# Altium schematic sheet core.SchDoc
size A4; SheetNumber: 3; SheetTotal: 5
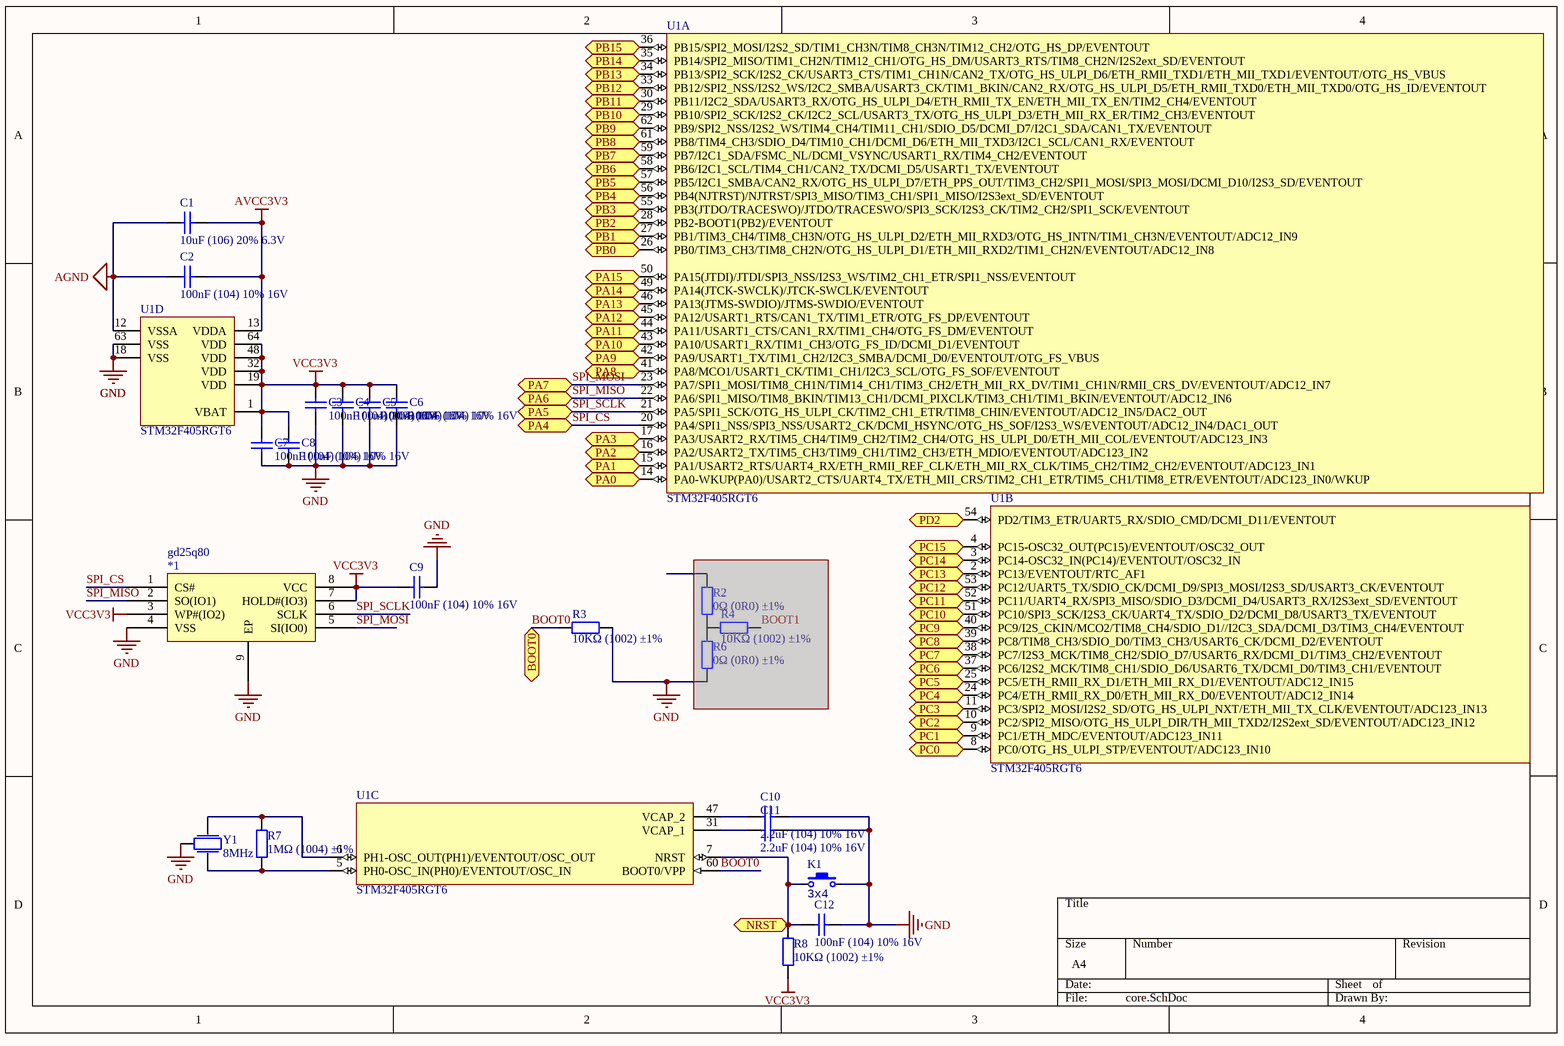
[diagram p0: core.SchDoc]

## Parts
*1  gd25q80  [USON-8]
C1  10uF (106) 20% 6.3V  [LC-0402_C]
C2  100nF (104) 10% 16V  [LC-0402_C]
C3  100nF (104) 10% 16V  [LC-0402_C]
C4  100nF (104) 10% 16V  [LC-0402_C]
C5  100nF (104) 10% 16V  [LC-0402_C]
C6  100nF (104) 10% 16V  [LC-0402_C]
C7  100nF (104) 10% 16V  [LC-0402_C]
C8  100nF (104) 10% 16V  [LC-0402_C]
C9  100nF (104) 10% 16V  [LC-0402_C]
C10  2.2uF (104) 10% 16V  [LC-0402_C]
C11  2.2uF (104) 10% 16V  [LC-0402_C]
C12  100nF (104) 10% 16V  [LC-0402_C]
K1  value 3x4  [ButtonTACT_3x4x2_180]  (hidden comment: TACT 2P)
R2  0Ω (0R0) ±1%  [LC-0402_R]  (masked out: inside a compile mask, not in the netlist)
R3  10KΩ (1002) ±1%  [LC-0402_R]
R4  10KΩ (1002) ±1%  [LC-0402_R]  (masked out: inside a compile mask, not in the netlist)
R6  0Ω (0R0) ±1%  [LC-0402_R]  (masked out: inside a compile mask, not in the netlist)
R7  1MΩ (1004) ±1%  [LC-0402_R]
R8  10KΩ (1002) ±1%  [LC-0402_R]
U1  STM32F405RGT6  [LC-LQFP-64_10x10x05P]  (parts A,B,C,D of 4)
Y1  8MHz  [晶振-3P]

## Ports
BOOT0 (bidir), NRST (bidir), PA0 (bidir), PA1 (bidir), PA2 (bidir), PA3 (bidir), PA4 (bidir), PA5 (bidir), PA6 (bidir), PA7 (bidir), PA8 (bidir), PA9 (bidir), PA10 (bidir), PA11 (bidir), PA12 (bidir), PA13 (bidir), PA14 (bidir), PA15 (bidir), PB0 (bidir), PB1 (bidir), PB2 (bidir), PB3 (bidir), PB4 (bidir), PB5 (bidir), PB6 (bidir), PB7 (bidir), PB8 (bidir), PB9 (bidir), PB10 (bidir), PB11 (bidir), PB12 (bidir), PB13 (bidir), PB14 (bidir), PB15 (bidir), PC0 (bidir), PC1 (bidir), PC2 (bidir), PC3 (bidir), PC4 (bidir), PC5 (bidir), PC6 (bidir), PC7 (bidir), PC8 (bidir), PC9 (bidir), PC10 (bidir), PC11 (bidir), PC12 (bidir), PC13 (bidir), PC14 (bidir), PC15 (bidir), PD2 (bidir)

## Nets
AGND: C1.1 C2.2 U1.12(VSSA)
AVCC3V3: C1.2 C2.1 U1.13(VDDA)
GND: *1.4(VSS) *1.9(EP) C3.1 C4.1 C5.1 C6.1 C7.1 C8.1 C9.1 C10.1 C11.1 C12.1 K1.2 R3.1 U1.18(VSS) U1.63(VSS) Y1.2
VCC3V3: *1.3(WP#(IO2)) *1.7(HOLD#(IO3)) *1.8(VCC) C3.2 C4.2 C5.2 C6.2 C7.2 C8.2 C9.2 R8.1 U1.1(VBAT) U1.19(VDD) U1.32(VDD) U1.48(VDD) U1.64(VDD)
BOOT0: R3.2 U1.60(BOOT0/VPP) ; port BOOT0
NRST: C12.2 K1.1 R8.2 U1.7(NRST) ; port NRST
PA0: U1.14(PA0-WKUP(PA0)/USART2_CTS/UART4_TX/ETH_MII_CRS/TIM2_CH1_ETR/TIM5_CH1/TIM8_ETR/EVENTOUT/ADC123_IN0/WKUP) ; port PA0
PA1: U1.15(PA1/USART2_RTS/UART4_RX/ETH_RMII_REF_CLK/ETH_MII_RX_CLK/TIM5_CH2/TIM2_CH2/EVENTOUT/ADC123_IN1) ; port PA1
PA2: U1.16(PA2/USART2_TX/TIM5_CH3/TIM9_CH1/TIM2_CH3/ETH_MDIO/EVENTOUT/ADC123_IN2) ; port PA2
PA3: U1.17(PA3/USART2_RX/TIM5_CH4/TIM9_CH2/TIM2_CH4/OTG_HS_ULPI_D0/ETH_MII_COL/EVENTOUT/ADC123_IN3) ; port PA3
PA8: U1.41(PA8/MCO1/USART1_CK/TIM1_CH1/I2C3_SCL/OTG_FS_SOF/EVENTOUT) ; port PA8
PA9: U1.42(PA9/USART1_TX/TIM1_CH2/I2C3_SMBA/DCMI_D0/EVENTOUT/OTG_FS_VBUS) ; port PA9
PA10: U1.43(PA10/USART1_RX/TIM1_CH3/OTG_FS_ID/DCMI_D1/EVENTOUT) ; port PA10
PA11: U1.44(PA11/USART1_CTS/CAN1_RX/TIM1_CH4/OTG_FS_DM/EVENTOUT) ; port PA11
PA12: U1.45(PA12/USART1_RTS/CAN1_TX/TIM1_ETR/OTG_FS_DP/EVENTOUT) ; port PA12
PA13: U1.46(PA13(JTMS-SWDIO)/JTMS-SWDIO/EVENTOUT) ; port PA13
PA14: U1.49(PA14(JTCK-SWCLK)/JTCK-SWCLK/EVENTOUT) ; port PA14
PA15: U1.50(PA15(JTDI)/JTDI/SPI3_NSS/I2S3_WS/TIM2_CH1_ETR/SPI1_NSS/EVENTOUT) ; port PA15
PB0: U1.26(PB0/TIM3_CH3/TIM8_CH2N/OTG_HS_ULPI_D1/ETH_MII_RXD2/TIM1_CH2N/EVENTOUT/ADC12_IN8) ; port PB0
PB1: U1.27(PB1/TIM3_CH4/TIM8_CH3N/OTG_HS_ULPI_D2/ETH_MII_RXD3/OTG_HS_INTN/TIM1_CH3N/EVENTOUT/ADC12_IN9) ; port PB1
PB2: U1.28(PB2-BOOT1(PB2)/EVENTOUT) ; port PB2
PB3: U1.55(PB3(JTDO/TRACESWO)/JTDO/TRACESWO/SPI3_SCK/I2S3_CK/TIM2_CH2/SPI1_SCK/EVENTOUT) ; port PB3
PB4: U1.56(PB4(NJTRST)/NJTRST/SPI3_MISO/TIM3_CH1/SPI1_MISO/I2S3ext_SD/EVENTOUT) ; port PB4
PB5: U1.57(PB5/I2C1_SMBA/CAN2_RX/OTG_HS_ULPI_D7/ETH_PPS_OUT/TIM3_CH2/SPI1_MOSI/SPI3_MOSI/DCMI_D10/I2S3_SD/EVENTOUT) ; port PB5
PB6: U1.58(PB6/I2C1_SCL/TIM4_CH1/CAN2_TX/DCMI_D5/USART1_TX/EVENTOUT) ; port PB6
PB7: U1.59(PB7/I2C1_SDA/FSMC_NL/DCMI_VSYNC/USART1_RX/TIM4_CH2/EVENTOUT) ; port PB7
PB8: U1.61(PB8/TIM4_CH3/SDIO_D4/TIM10_CH1/DCMI_D6/ETH_MII_TXD3/I2C1_SCL/CAN1_RX/EVENTOUT) ; port PB8
PB9: U1.62(PB9/SPI2_NSS/I2S2_WS/TIM4_CH4/TIM11_CH1/SDIO_D5/DCMI_D7/I2C1_SDA/CAN1_TX/EVENTOUT) ; port PB9
PB10: U1.29(PB10/SPI2_SCK/I2S2_CK/I2C2_SCL/USART3_TX/OTG_HS_ULPI_D3/ETH_MII_RX_ER/TIM2_CH3/EVENTOUT) ; port PB10
PB11: U1.30(PB11/I2C2_SDA/USART3_RX/OTG_HS_ULPI_D4/ETH_RMII_TX_EN/ETH_MII_TX_EN/TIM2_CH4/EVENTOUT) ; port PB11
PB12: U1.33(PB12/SPI2_NSS/I2S2_WS/I2C2_SMBA/USART3_CK/TIM1_BKIN/CAN2_RX/OTG_HS_ULPI_D5/ETH_RMII_TXD0/ETH_MII_TXD0/OTG_HS_ID/EVENTOUT) ; port PB12
PB13: U1.34(PB13/SPI2_SCK/I2S2_CK/USART3_CTS/TIM1_CH1N/CAN2_TX/OTG_HS_ULPI_D6/ETH_RMII_TXD1/ETH_MII_TXD1/EVENTOUT/OTG_HS_VBUS) ; port PB13
PB14: U1.35(PB14/SPI2_MISO/TIM1_CH2N/TIM12_CH1/OTG_HS_DM/USART3_RTS/TIM8_CH2N/I2S2ext_SD/EVENTOUT) ; port PB14
PB15: U1.36(PB15/SPI2_MOSI/I2S2_SD/TIM1_CH3N/TIM8_CH3N/TIM12_CH2/OTG_HS_DP/EVENTOUT) ; port PB15
PC0: U1.8(PC0/OTG_HS_ULPI_STP/EVENTOUT/ADC123_IN10) ; port PC0
PC1: U1.9(PC1/ETH_MDC/EVENTOUT/ADC123_IN11) ; port PC1
PC2: U1.10(PC2/SPI2_MISO/OTG_HS_ULPI_DIR/TH_MII_TXD2/I2S2ext_SD/EVENTOUT/ADC123_IN12) ; port PC2
PC3: U1.11(PC3/SPI2_MOSI/I2S2_SD/OTG_HS_ULPI_NXT/ETH_MII_TX_CLK/EVENTOUT/ADC123_IN13) ; port PC3
PC4: U1.24(PC4/ETH_RMII_RX_D0/ETH_MII_RX_D0/EVENTOUT/ADC12_IN14) ; port PC4
PC5: U1.25(PC5/ETH_RMII_RX_D1/ETH_MII_RX_D1/EVENTOUT/ADC12_IN15) ; port PC5
PC6: U1.37(PC6/I2S2_MCK/TIM8_CH1/SDIO_D6/USART6_TX/DCMI_D0/TIM3_CH1/EVENTOUT) ; port PC6
PC7: U1.38(PC7/I2S3_MCK/TIM8_CH2/SDIO_D7/USART6_RX/DCMI_D1/TIM3_CH2/EVENTOUT) ; port PC7
PC8: U1.39(PC8/TIM8_CH3/SDIO_D0/TIM3_CH3/USART6_CK/DCMI_D2/EVENTOUT) ; port PC8
PC9: U1.40(PC9/I2S_CKIN/MCO2/TIM8_CH4/SDIO_D1//I2C3_SDA/DCMI_D3/TIM3_CH4/EVENTOUT) ; port PC9
PC10: U1.51(PC10/SPI3_SCK/I2S3_CK/UART4_TX/SDIO_D2/DCMI_D8/USART3_TX/EVENTOUT) ; port PC10
PC11: U1.52(PC11/UART4_RX/SPI3_MISO/SDIO_D3/DCMI_D4/USART3_RX/I2S3ext_SD/EVENTOUT) ; port PC11
PC12: U1.53(PC12/UART5_TX/SDIO_CK/DCMI_D9/SPI3_MOSI/I2S3_SD/USART3_CK/EVENTOUT) ; port PC12
PC13: U1.2(PC13/EVENTOUT/RTC_AF1) ; port PC13
PC14: U1.3(PC14-OSC32_IN(PC14)/EVENTOUT/OSC32_IN) ; port PC14
PC15: U1.4(PC15-OSC32_OUT(PC15)/EVENTOUT/OSC32_OUT) ; port PC15
PD2: U1.54(PD2/TIM3_ETR/UART5_RX/SDIO_CMD/DCMI_D11/EVENTOUT) ; port PD2
SPI_CS: *1.1(CS#) U1.20(PA4/SPI1_NSS/SPI3_NSS/USART2_CK/DCMI_HSYNC/OTG_HS_SOF/I2S3_WS/EVENTOUT/ADC12_IN4/DAC1_OUT) ; port PA4
SPI_MISO: *1.2(SO(IO1)) U1.22(PA6/SPI1_MISO/TIM8_BKIN/TIM13_CH1/DCMI_PIXCLK/TIM3_CH1/TIM1_BKIN/EVENTOUT/ADC12_IN6) ; port PA6
SPI_MOSI: *1.5(SI(IO0)) U1.23(PA7/SPI1_MOSI/TIM8_CH1N/TIM14_CH1/TIM3_CH2/ETH_MII_RX_DV/TIM1_CH1N/RMII_CRS_DV/EVENTOUT/ADC12_IN7) ; port PA7
SPI_SCLK: *1.6(SCLK) U1.21(PA5/SPI1_SCK/OTG_HS_ULPI_CK/TIM2_CH1_ETR/TIM8_CHIN/EVENTOUT/ADC12_IN5/DAC2_OUT) ; port PA5
NetC10_2: C10.2 U1.47(VCAP_2)
NetC11_2: C11.2 U1.31(VCAP_1)
NetR7_1: R7.1 U1.5(PH0-OSC_IN(PH0)/EVENTOUT/OSC_IN) Y1.1
NetR7_2: R7.2 U1.6(PH1-OSC_OUT(PH1)/EVENTOUT/OSC_OUT) Y1.3

## Library data of the parts
C1 = 0402 10uF (106) 20% 6.3V: 贴片电容; ComponentLink1Description: 供应商链接; ComponentLink1URL: http://www.szlcsc.com/product/details_16204.html; Package: 0402; Supplier: LC; SuppliersPartNumber: C15525
C2-C12 = 0402 100nF (104) 10% 16V: 贴片电容; ComponentLink1Description: 供应商链接; ComponentLink1URL: http://www.szlcsc.com/product/details_1877.html; Package: 0402; Supplier: LC; SuppliersPartNumber: C1525
K1 = ButtonTACT_3x4x2_180: Button; type: TACT 2P
R2 R6 = 0402 0Ω (0R0) 1%: 贴片电阻; ComponentLink1Description: 供应商链接; ComponentLink1URL: http://www.szlcsc.com/product/details_17853.html; Package: 0402; Supplier: LC; SuppliersPartNumber: C17168
R3 R4 R8 = 0402 10KΩ (1002) 1%: 贴片电阻; ComponentLink1Description: 供应商链接; ComponentLink1URL: http://www.szlcsc.com/product/details_26487.html; Package: 0402; Supplier: LC; SuppliersPartNumber: C25744
R7 = 0402 1MΩ (1004) 1%: 贴片电阻; ComponentLink1Description: 供应商链接; ComponentLink1URL: http://www.szlcsc.com/product/details_26826.html; Package: 0402; Supplier: LC; SuppliersPartNumber: C26083
U1 = STM32F405RGT6: ARM; ComponentLink1Description: 供应商链接; ComponentLink1URL: http://www.szlcsc.com/product/details_16424.html; Package: LQFP-64_10x10x05P; Supplier: LC; SuppliersPartNumber: C15742
Y1 = 晶振-3Pin: 村田贴片